# EAGLE design ArduinoRadioV2 (EAGLE 9.6.2)
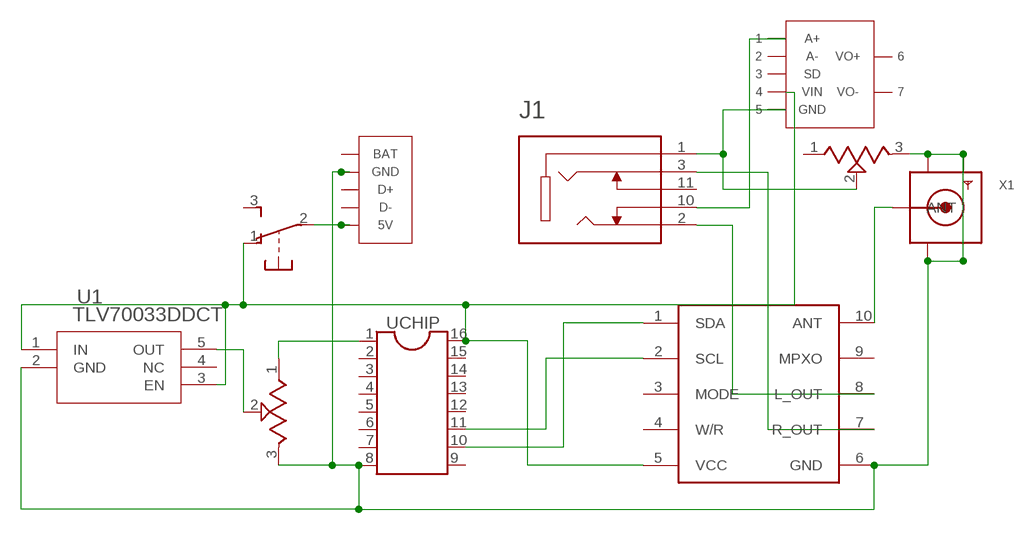
[diagram p0: schematic, sheet 1]

## Parts
IC1  UCHIP  [UCHIP]
J1  SJ1-3525N  [CUI_SJ1-3525N]
S1  EG1213  [EG1213]
TEA5767  TEA5767BREAKOUT  [TEA5767MM2]
TUNE  3352T-1-103LF  [TRIM_3352T-1-103LF]
U1  TLV70033DDCT  [DDC5]
U$1  AMP  [AMP]
U$2  MICROLIPO  [MICROLIPO]
VOL  3352T-1-103LF  [TRIM_3352T-1-103LF]
X1  SMACONNECTOR  [SMA90_DIP]

## Nets
5V: IC1.16(V_EXT) S1.1(1:O) TEA5767.5(VCC) U1.1(IN) U1.3(EN) U$1.VIN
AIN: J1.10 U$1.A+
ANT: TEA5767.10(ANT) X1.ANTENNA(ANT)
GND: IC1.8(GND) TEA5767.6(GND) TUNE.3(CW) U1.2(GND) U$2.P$1(GND) U$2.P$2(GND) U$2.P$3(GND) U$2.P$4(GND) U$2.P$8(GND) VOL.3(CW) X1.GND1 X1.GND2 X1.GND3 X1.GND4
LO: J1.2 TEA5767.8(L_OUT)
N$2: IC1.1(D1/A1) TUNE.1(CCW)
RO: J1.3 TEA5767.7(R_OUT)
SCL: IC1.11(D11) TEA5767.2(SCL)
SDA: IC1.10(D10) TEA5767.1(SDA)
TUNE: TUNE.2(WIPER) U1.5(OUT)
VOL: J1.1 U$1.GND VOL.2(WIPER)
VS: S1.2(1:P) U$2.P$5(5V)
Unconnected: IC1.2(D2/A2) IC1.3(D3/A3) IC1.4(D4/A4) IC1.5(D5/A5) IC1.6(D6) IC1.7(D7) IC1.9(D9) IC1.12(D12) IC1.13(D13) IC1.14(D14/A14) IC1.15(D15/A15) J1.11 S1.3(1:S) S1.MT1(MT) S1.MT2(MT) TEA5767.3(MODE) TEA5767.4(W/R) TEA5767.9(MPXO) U1.4(NC) U$1.A- U$1.SD U$1.VO+ U$1.VO- U$2.P$6(D-) U$2.P$7(D+) U$2.P$9(BAT) VOL.1(CCW)

## Library data of the parts
IC1 = uChip:UCHIP: uChip: Arduino Zero compatible board in a DIL16 Package
J1 = SJ1-3525N:SJ1-3525N: 3.5 mm Right-Angle Stereo Jack, 5 Pin PCB Mount, Non-Threaded; AVAILABILITY: Unavailable; CUI_PURCHASE_URL: https://www.cuidevices.com/product/interconnect/connectors/audio-connectors/jacks/sj1-352xn-series?utm_source=snapeda.com&utm_medium=referral&utm_campaign=snapedaBOM; DESCRIPTION: 3.5 mm, Stereo, Right Angle, Through Hole, Audio Jack Connector; MF: CUI Devices; MP: SJ1-3525N; PACKAGE: None; PRICE: None
S1 = adafruit:EG1213: E-Switch right-angle slide SPDT Part #EG1213 http://www.ladyada.net/library/eagle
TEA5767 = MyParts:TEA5767BREAKOUT
TUNE VOL = 3352T-1-103LF:3352T-1-103LF: 10 kOhms 0.5W, 1/2W Through Hole Thumbwheel Potentiometer Top Adjustment; DESCRIPTION: 10 kOhms 0.5W, 1/2W Through Hole Thumbwheel Potentiometer Top Adjustment; DIGI-KEY_PART_NUMBER: 3352T-103LF-ND; DIGI-KEY_PURCHASE_URL: https://www.digikey.com/product-detail/en/bourns-inc/3352T-1-103LF/3352T-103LF-ND/1088341?utm_source=snapeda&utm_medium=aggregator&utm_campaign=symbol; MF: Bourns; MP: 3352T-1-103LF; PACKAGE: 2012 Bourns
U1 = ul_TLV70033DDCT:TLV70033DDCT; BUILT_BY: EMA_UL_Team; MANUFACTURER: Texas Instruments; MANUFACTURER_PART_NUMBER: TLV70033DDCT; VENDOR: Texas Instruments
U$1 = amp:AMP
U$2 = microlipo:MICROLIPO
X1 = better14pin:SMACONNECTOR: SMA Connector 90° DIP SMA Connector, 50 Ohm (4UConnector: 07259)

## Board
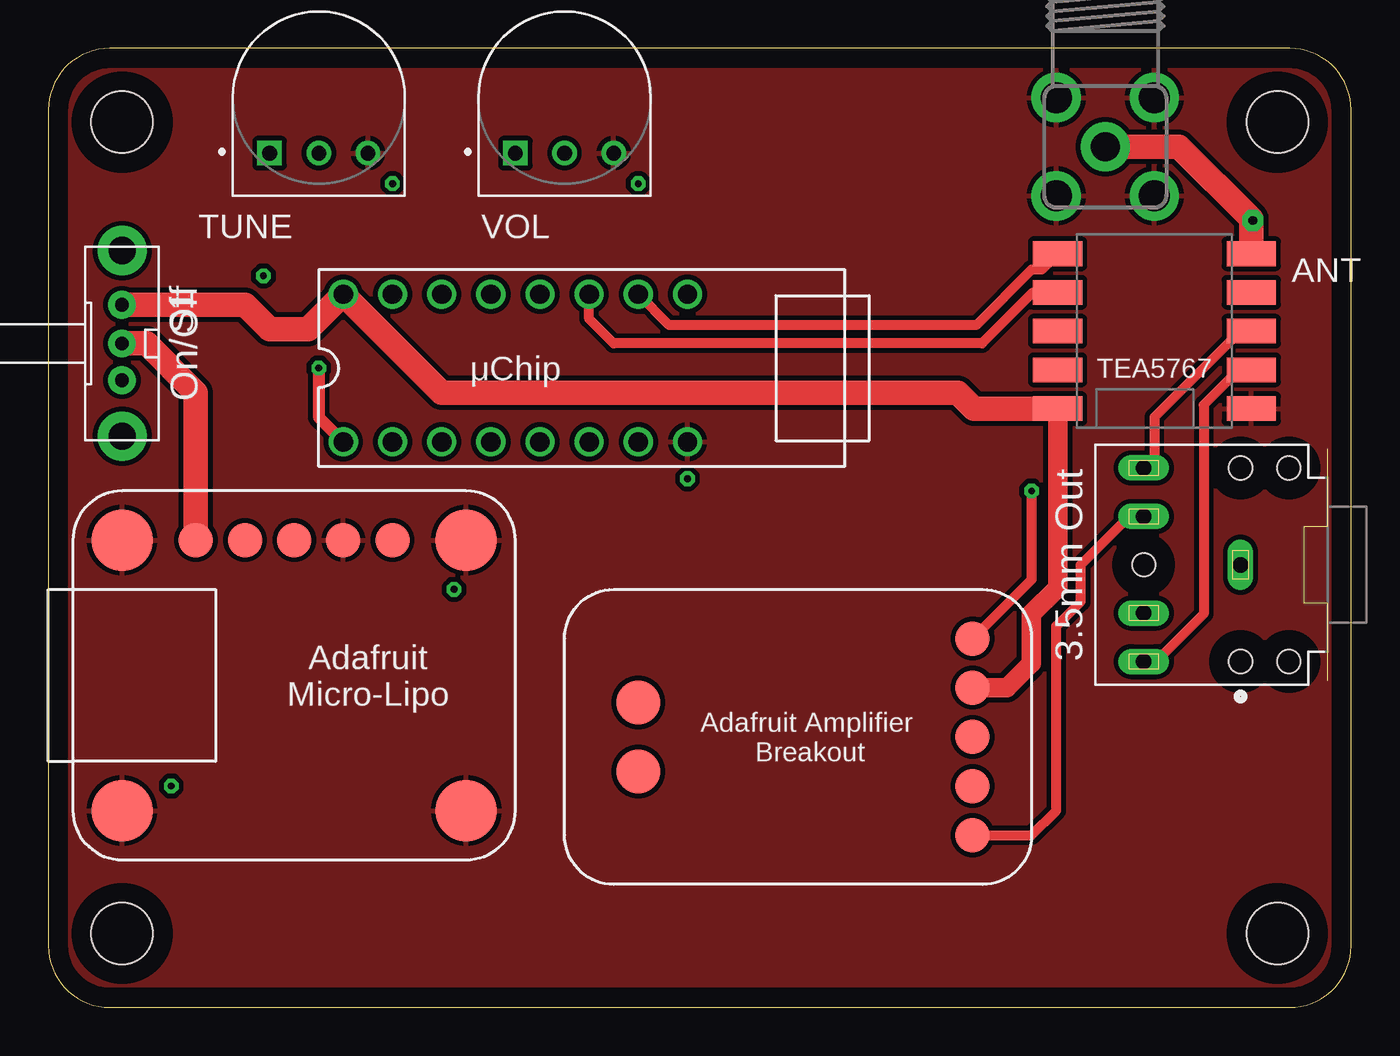
[diagram p1: board, top side]
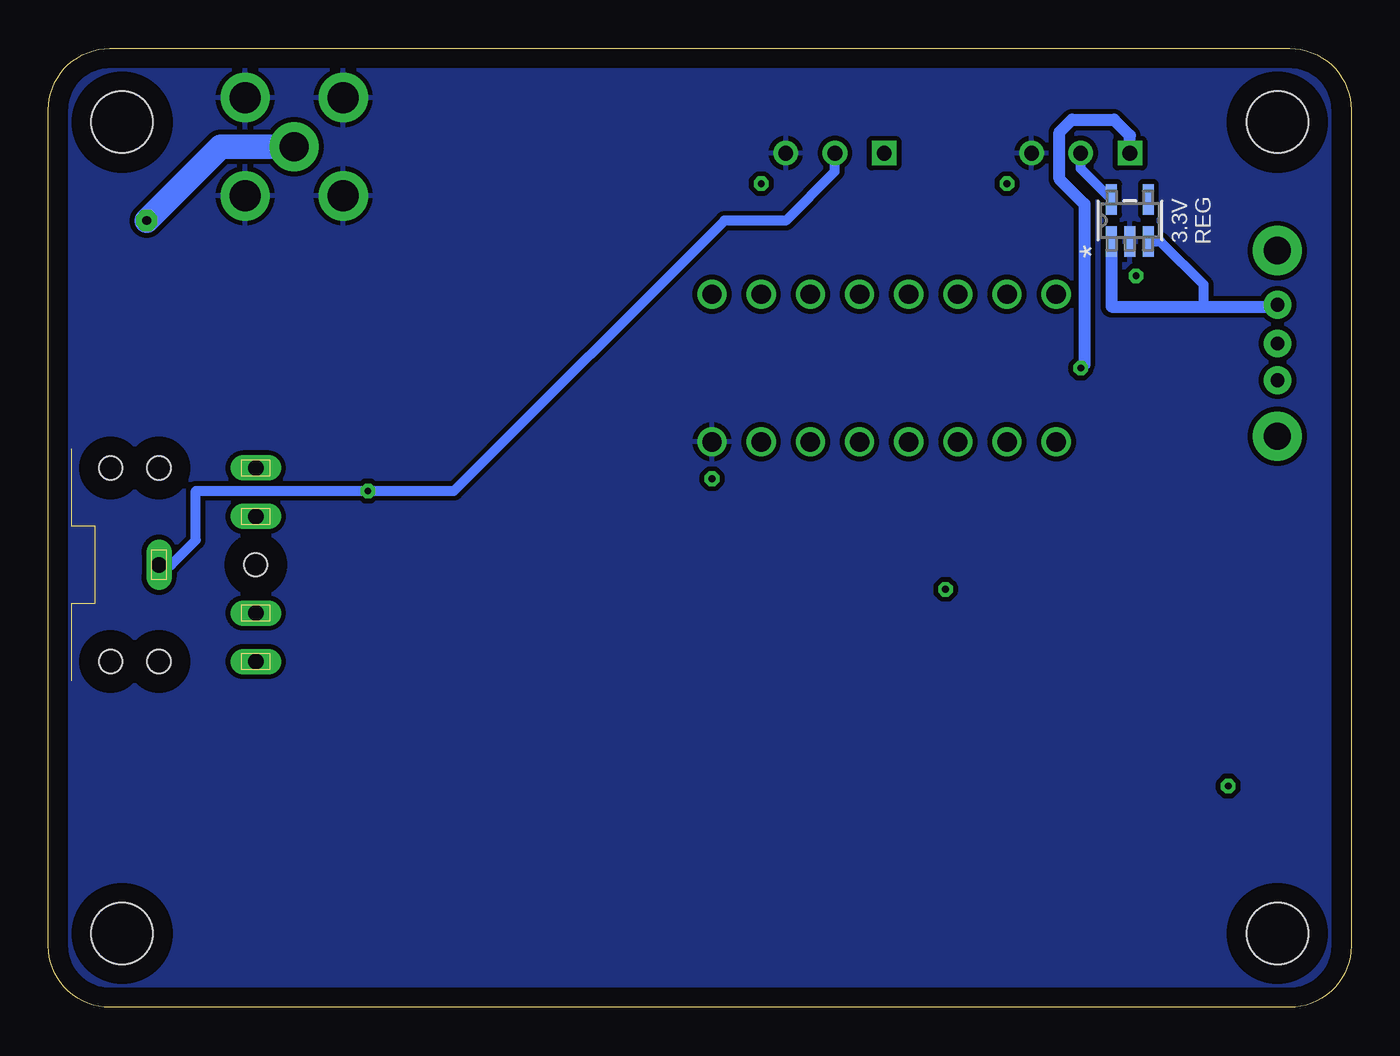
[diagram p2: board, bottom side, seen from below]

Size 67.31 x 49.53 mm. Coordinates in mm from the lower left corner, seen from the top.
Outline: 0,46.35 0,3.17 arc90 3.17,0 64.14,0 arc90 67.31,3.17 67.31,46.35 arc90 64.14,49.53 3.17,49.53 arc90 0,46.35
Copper layers (1*16): Top 0.035mm / dielectric 1.5mm / Bottom 0.035mm
Design rules "default": minimum track width 6mil, minimum drill 0.35mm, track to track 6mil, track to pad 6mil, pad to pad 6mil, via to via 6mil, smd to smd 6mil, copper to edge 40mil, drill to drill 6mil, minimum pad ring 10mil, minimum via ring 8mil, stop-mask expansion 4mil, vias tented up to drill 0mil, thermal gap 10mil
Holes 3.17 mm at 3.81,3.81 3.81,45.72 63.5,45.72 63.5,3.81

### Footprints (pad centres in the part's own frame; a part is rotated, then mirrored left to right if it is on the bottom)
UCHIP = drill 1 pad 1.5: 1 -8.89,-3.81; 2 -6.35,-3.81; 3 -3.81,-3.81; 4 -1.27,-3.81; 5 1.27,-3.81; 6 3.81,-3.81; 7 6.35,-3.81; 8 8.89,-3.81; 9 8.89,3.81; 10 6.35,3.81; 11 3.81,3.81; 12 1.27,3.81; 13 -1.27,3.81; 14 -3.81,3.81; 15 -6.35,3.81; 16 -8.89,3.81
CUI_SJ1-3525N = drill 0.8 long: 1 0,0; 2 5,-5; 3 5,5; 10 5,-2.5; 11 5,2.5 | hole 1.2: -2.5,5; 0,5; 5,0; -2.5,-5; 0,-5
EG1213 = drill 0.7 pad 1.422: 1 -2,0; 2 0,0; 3 1.9,0 | drill 1.4 pad 2.54: MT1 -4.8,0; MT2 4.8,0
TEA5767MM2 = smd 2.54 x 1.27: 1 -5,4; 2 -5,2; 3 -5,0; 4 -5,-2; 5 -5,-4; 6 5,-4; 7 5,-2; 8 5,0; 9 5,2; 10 5,4
TRIM_3352T-1-103LF = drill 0.76 pad 1.16 square: 1 -2.54,-2.87 | drill 0.76 pad 1.16: 2 0,-2.87; 3 2.54,-2.87
DDC5 = smd 1.575 x 0.559: 1 -1.092,0.95; 2 -1.092,0; 3 -1.092,-0.95; 4 1.092,-0.95; 5 1.092,0.95
AMP = smd 1.778 x 1.778: A+ 3.048,12.7; A- 3.048,10.16; GND 3.048,2.54; SD 3.048,7.62; VIN 3.048,5.08 | smd 2.286 x 2.286: VO+ 20.32,9.398; VO- 20.32,5.842
MICROLIPO = smd 3.175 x 3.175: P$1 2.54,2.54; P$2 2.54,16.51; P$3 20.32,16.51; P$4 20.32,2.54 | smd 1.778 x 1.778: P$5 6.35,16.51; P$6 8.89,16.51; P$7 11.43,16.51; P$8 13.97,16.51; P$9 16.51,16.51
SMA90_DIP = drill 1.5 pad 2.54: ANTENNA 0,0 | drill 1.6 pad 2.54: GND1 -2.54,2.54; GND2 2.54,2.54; GND3 -2.54,-2.54; GND4 2.54,-2.54

### Placement (x,y rotation side)
IC1  24.13,33.02 0 top
J1  61.59,22.86 180 top
S1  3.81,34.29 270 top
TEA5767  57.15,34.92 0 top
TUNE  13.97,46.99 0 top
U1  11.43,40.64 90 bottom
U$1  50.8,21.59 180 top
U$2  1.27,7.62 0 top
VOL  26.67,46.99 0 top
X1  54.61,44.45 0 top

### Tracks (layer width: path | path; a pad name or v marks a point on that pad's centre or on a via)
5V
  Top 1.016: TEA5767.5 52.15,21.67 50.8,20.32 50.8,17.78 49.53,16.51 U$1.VIN
  Top 1.27: TEA5767.5 47.81,30.93 46.99,31.75 20.32,31.75 IC1.16 13.43,35.02 11.43,35.02 10.16,36.29 S1.1
  Bottom 0.508: 7.62,36.2 7.62,37.32 9.85,39.55 U1.3
  Bottom 0.61: U1.1 12.38,36.2 7.62,36.2 3.9,36.2 S1.1
AIN
  Top 0.508: U$1.A+ 50.8,8.89 52.07,10.16 52.07,19.68 53.34,20.95 53.34,22.86 55.84,25.36 J1.10
ANT  (via drill 0.45 pad 1.1)
  Top 1.27: TEA5767.10 62.15,40.72 58.42,44.45 X1.ANTENNA
  Bottom 1.27: X1.ANTENNA 58.42,44.45 v62.23,40.64
GND
  pour Top (isolate 0.254): 67.31,3.17 67.31,46.35 arc90 64.14,49.53 3.17,49.53 arc90 0,46.35 0,3.17 arc90 3.17,0 64.14,0 arc90
  pour Bottom (isolate 0.254): 64.14,0 3.17,0 arc-90 0,3.17 0,46.35 arc-90 3.17,49.53 64.14,49.53 arc-90 67.31,46.35 67.31,3.17 arc-90
LO
  Top 0.508: TEA5767.8 61.59,34.92 57.15,30.48 57.15,28.41 J1.2
N$2  (via drill 0.35)
  Top 0.61: IC1.1 13.97,30.48 v13.97,33.02
  Bottom 0.61: v13.97,33.02 13.78,33.21 13.78,41.49 15.06,42.77 15.06,45.21 14.42,45.85 12.25,45.85 11.43,45.03 TUNE.1
N$3  (via drill 0.35)
  other vias: 11.11,37.78
N$4  (via drill 0.35)
  other vias: 20.95,21.59
N$5  (via drill 0.35)
  other vias: 6.35,11.43
N$6  (via drill 0.35)
  other vias: 33.02,27.3
N$7  (via drill 0.35)
  other vias: 17.78,42.55
N$8  (via drill 0.35)
  other vias: 30.48,42.55
RO
  Top 0.508: TEA5767.7 61.5,32.92 59.69,31.11 59.69,20.32 57.23,17.86 J1.3
SCL
  Top 0.508: TEA5767.2 50.88,36.92 48.24,34.29 29.21,34.29 27.94,35.56 IC1.11
SDA
  Top 0.508: TEA5767.1 51.33,38.1 50.8,38.1 47.94,35.24 32.07,35.24 IC1.10
TUNE
  Bottom 0.508: U1.5 13.97,43.32 TUNE.2
VOL  (via drill 0.35)
  Top 0.508: v50.8,26.67 50.8,22.1 U$1.GND
  Bottom 0.508: J1.1 60.96,22.86 59.69,24.13 59.69,26.67 v50.8,26.67 46.35,26.67 32.38,40.64 29.21,40.64 26.67,43.18 VOL.2
VS
  Top 1.27: U$2.P$5 7.62,31.75 5.08,34.29 S1.2

### Text on the board
tPlace: On/Off
bPlace: 3.3V / REG
tNames: ANT | TEA5767 | 3.5mm Out | Adafruit / Micro-Lipo | Adafruit Amplifier / Breakout